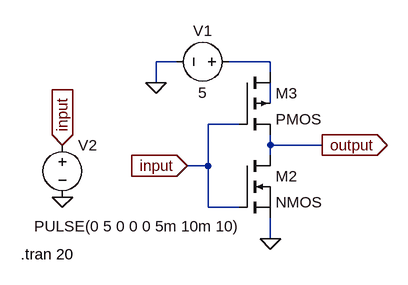
[diagram p0: schematic InverterUsingCMOS.asc]
InverterUsingCMOS.asc, the LTspice schematic file:
Version 4.1
SHEET 1 880 680
WIRE 16 48 -16 48
WIRE 160 48 96 48
WIRE 160 64 160 48
WIRE -16 80 -16 48
WIRE 160 112 160 80
WIRE 112 144 64 144
WIRE 160 176 160 160
WIRE 240 176 160 176
WIRE 160 192 160 176
WIRE 64 208 64 144
WIRE 64 208 32 208
WIRE 64 272 64 208
WIRE 112 272 64 272
WIRE 160 320 160 288
FLAG 160 320 0
FLAG -16 80 0
FLAG 32 208 input
IOPIN 32 208 In
FLAG 240 176 output
IOPIN 240 176 Out
FLAG -160 256 0
FLAG -160 176 input
IOPIN -160 176 In
SYMBOL voltage 112 48 R90
WINDOW 0 -32 56 VBottom 2
WINDOW 3 32 56 VTop 2
WINDOW 123 0 0 Left 0
WINDOW 39 0 0 Left 0
SYMATTR InstName V1
SYMATTR Value 5
SYMBOL voltage -160 160 R0
WINDOW 3 -43 141 Left 2
WINDOW 123 0 0 Left 0
WINDOW 39 0 0 Left 0
SYMATTR InstName V2
SYMATTR Value PULSE(0 5 0 0 0 5m 10m 10)
SYMBOL nmos 112 192 R0
SYMATTR InstName M2
SYMBOL pmos4 112 64 R0
SYMATTR InstName M3
TEXT -224 344 Left 2 !.tran 20

The netlist it stands for:
* InverterUsingCMOS.asc
V1 N001 0 5
V2 input 0 PULSE(0 5 0 0 0 5m 10m 10)
M2 output input 0 0 NMOS
M3 N001 input output N002 PMOS
.model NMOS NMOS
.model PMOS PMOS
.lib standard.mos
.tran 20
.backanno
.end